# Altium schematic sheet ICSL_PS_BMD.SchDoc
size A
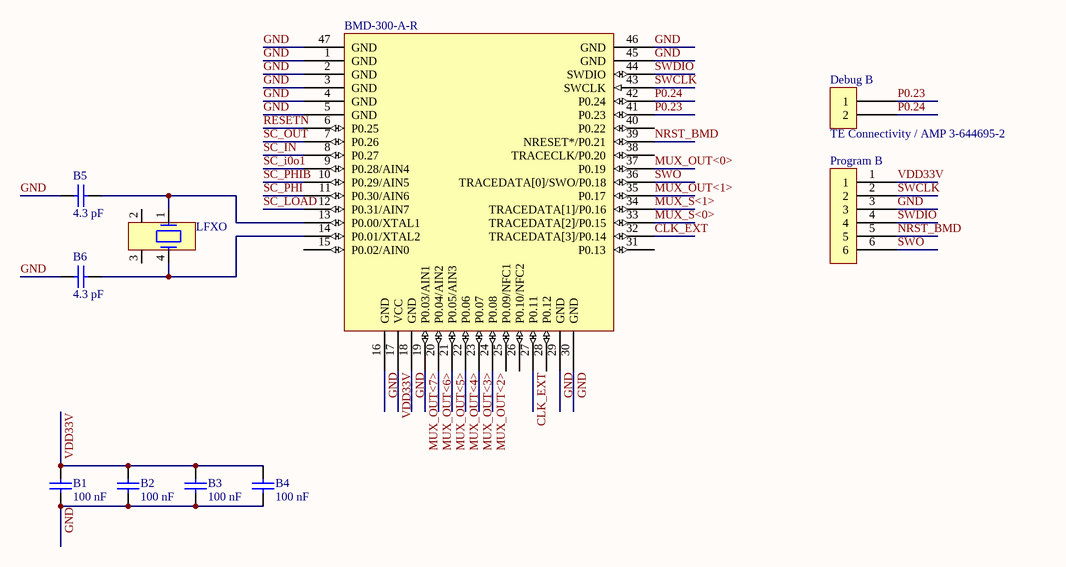
[diagram p0: ICSL_PS_BMD.SchDoc]

## Parts
B1  100 nF  [CAPC1608X90X35NL15T15]
B2  100 nF  [CAPC1608X90X35NL15T15]
B3  100 nF  [CAPC1608X90X35NL15T15]
B4  100 nF  [CAPC1608X90X35NL15T15]
B5  4.3 pF  [CAPC1608X90X35NL15T15]
B6  4.3 pF  [CAPC1608X90X35NL15T15]
BMD-300-A-R  Rigado BMD-300-A-R  [BMD-300 easy]  (value not drawn)
Debug_B  TE Connectivity / AMP 3-644695-2  [PCB-i8m17woc8q0u0fbeoczf-1]
LFXO  Abracon ABS25-32.768KHZ-6-T  [XTAL_4SM_8X3R8]  (value not drawn)
Program_B  TE Connectivity / AMP 5-146281-6  [PCB-ceua2d6kgzjhmbkiz2sm-1]  (value not drawn)

## Nets
CLK_EXT: BMD-300-A-R.27(P0.11) BMD-300-A-R.32(TRACEDATA[3]/P0.14)
GND: B1.1 B2.1 B3.1 B4.1 B5.1 B6.1 BMD-300-A-R.1(GND) BMD-300-A-R.2(GND) BMD-300-A-R.3(GND) BMD-300-A-R.4(GND) BMD-300-A-R.5(GND) BMD-300-A-R.16(GND) BMD-300-A-R.18(GND) BMD-300-A-R.29(GND) BMD-300-A-R.30(GND) BMD-300-A-R.45(GND) BMD-300-A-R.46(GND) BMD-300-A-R.47(GND) Program_B.3
MUX_OUT<0>: BMD-300-A-R.37(P0.19)
MUX_OUT<1>: BMD-300-A-R.35(P0.17)
MUX_OUT<2>: BMD-300-A-R.24(P0.08)
MUX_OUT<3>: BMD-300-A-R.23(P0.07)
MUX_OUT<4>: BMD-300-A-R.22(P0.06)
MUX_OUT<5>: BMD-300-A-R.21(P0.05/AIN3)
MUX_OUT<6>: BMD-300-A-R.20(P0.04/AIN2)
MUX_OUT<7>: BMD-300-A-R.19(P0.03/AIN1)
MUX_S<0>: BMD-300-A-R.33(TRACEDATA[2]/P0.15)
MUX_S<1>: BMD-300-A-R.34(TRACEDATA[1]/P0.16)
NRST_BMD: BMD-300-A-R.39(NRESET*/P0.21) Program_B.5
P0.23: BMD-300-A-R.41(P0.23) Debug_B.1
P0.24: BMD-300-A-R.42(P0.24) Debug_B.2
RESETN: BMD-300-A-R.6(P0.25)
SC_i0o1: BMD-300-A-R.9(P0.28/AIN4)
SC_IN: BMD-300-A-R.8(P0.27)
SC_LOAD: BMD-300-A-R.12(P0.31/AIN7)
SC_OUT: BMD-300-A-R.7(P0.26)
SC_PHI: BMD-300-A-R.11(P0.30/AIN6)
SC_PHIB: BMD-300-A-R.10(P0.29/AIN5)
SWCLK: BMD-300-A-R.43(SWCLK) Program_B.2
SWDIO: BMD-300-A-R.44(SWDIO) Program_B.4
SWO: BMD-300-A-R.36(TRACEDATA[0]/SWO/P0.18) Program_B.6
VDD33V: B1.2 B2.2 B3.2 B4.2 BMD-300-A-R.17(VCC) Program_B.1
NetB5_2: B5.2 BMD-300-A-R.13(P0.00/XTAL1) LFXO.1
NetB6_2: B6.2 BMD-300-A-R.14(P0.01/XTAL2) LFXO.4

Not connected (* = marked no-connect by the designer): BMD-300-A-R 15(P0.02/AIN0) 25(P0.09/NFC1) 26(P0.10/NFC2) 28(P0.12) 31(P0.13) 38(TRACECLK/P0.20) 40(P0.22); LFXO 2 3

## Library data of the parts
B1-B4 B6 = 06035A391GAT2A: CAP CER 390PF 50V 2% NP0 0603; Capacitance: 3.9e-10 F; Dielectric Characteristic: C0G/NP0; Lead-Free Status: Lead Free; Voltage Rating (DC): 50.0 V; Capacitance Tolerance: ±2%; Case/Package: 0603; Octopart Url: https://octopart.com/06035a391gat2a-avx+interconnect+%2F+elco-7765157; OctopartID: 340afd766dc9ebcd; Packaging: Tape; RoHS: Compliant
B5 = CMP-175820-2: CAP CER 390PF 50V 2% NP0 0603; Capacitance: 3.9e-10 F; Dielectric Characteristic: C0G/NP0; Lead-Free Status: Lead Free; Voltage Rating (DC): 50.0 V; Capacitance Tolerance: ±2%; Case/Package: 0603; Octopart Url: https://octopart.com/06035a391gat2a-avx+interconnect+%2F+elco-7765157; OctopartID: 340afd766dc9ebcd; Packaging: Tape; RoHS: Compliant
BMD-300-A-R = BMD-300-A-R: Mod Ble 4.2 Nordic Nrf52832 Soc; OctopartID: f77f3a358f6828b8; Octopart URL: http://octopart.com/bmd-300-a-r-rigado-71327089; Manufacturer Part Number: BMD-300-A-R
Debug_B = CMP-2792ecc2f21af855-6: Connector Unshrouded Header 2 Position 2.54mm Solder Straight Thru-Hole; Voltage Rating (AC): 250 V; Number of Positions: 2; Mounting Angle: 180 °; Lead-Free Status: Lead Free; Shrouded: No; ELV Compliant: Compliant; Gender: Male; Flammability Rating: UL 94 V-0; Number of Rows: 1; Housing Color: Natural; Size-Width: 2.34 mm; Mounting Style: Through Hole; Orientation: Vertical; Lifecycle Status: Active; Manufacturer Part Number: 3-644695-2; OctopartID: 2792ecc2f21af855; RoHS: Compliant; Pin Pitch: 2.54 mm; Contact Plating: Tin; Housing Material: Polyester; Size-Length: 4.80 mm; Contact Material: Copper Alloy; Size-Height: 2.54 mm; Number of Contacts: 2; Packaging: Box, Bag; Octopart URL: http://octopart.com/3-644695-2-te+connectivity+%2F+amp-39514350
LFXO = CMP-779567-4: ABS25 Series 32.768 kHz ±20 ppm 6 pF -40 to +85 °C SMT Low Frequency Crystal; Frequency: 32.8 kHz; Equivalent Series Resistance (ESR): 50.0 kΩ; Lead-Free Status: Lead Free; Load Capacitance: 6.00 pF; REACH SVHC Compliance: No SVHC; Mounting Style: Surface Mount; Seller Landing  Url: https://octopart-clicks.com/click/track?country=US&ak=8157f166&sig=0e47fd3&sid=1106&ppid=9289409&vpid=78496461&ct=offers; OctopartID: a1e368643a447e24; Octopart Url: http://octopart.com/abs25-32.768khz-6-t-abracon-9289409; Manufacturer Part Number: ABS25-32.768KHZ-6-T; RoHS: Compliant; Number of Pins: 4; Packaging: Cut Tape (CT)
Program_B = 5-146281-2: Header; Breakaway; 0.100 in.; PC Board; Single; 6; 0.025 in.; 0.12 in.; 3 A; Gender: Male; Number of Contacts: 6; Lead-Free Status: Lead Free; ELV Compliant: Compliant; Lifecycle Status: Active; OctopartID: 4f28847cfb2a90ef; Manufacturer Part Number: 5-146281-2; Housing Color: Black; Flammability Rating: UL 94 V-0; Orientation: Vertical; Octopart URL: https://octopart.com/5-146281-6-te+connectivity+%2F+amp-40753677; Contact Plating: Tin, Tin over Nickel, Gold; Contact Material: Copper Alloy; RoHS: Compliant; Mounting Style: PCB